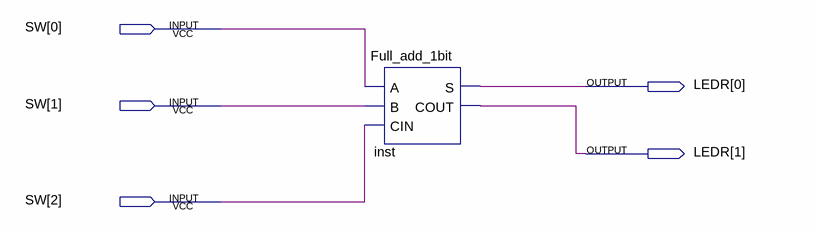
[diagram p0: schematic sheet]
// Quartus schematic Block_additionneur.bdf as structural Verilog: 1 symbols, 5 pins
module Block_additionneur (
  input  [2:0] SW,
  output [1:0] LEDR
);

  Full_add_1bit inst (.A(SW[0]), .B(SW[1]), .CIN(SW[2]), .S(LEDR[0]), .COUT(LEDR[1]));
endmodule
